# Altium schematic sheet Interface.SchDoc
size A4
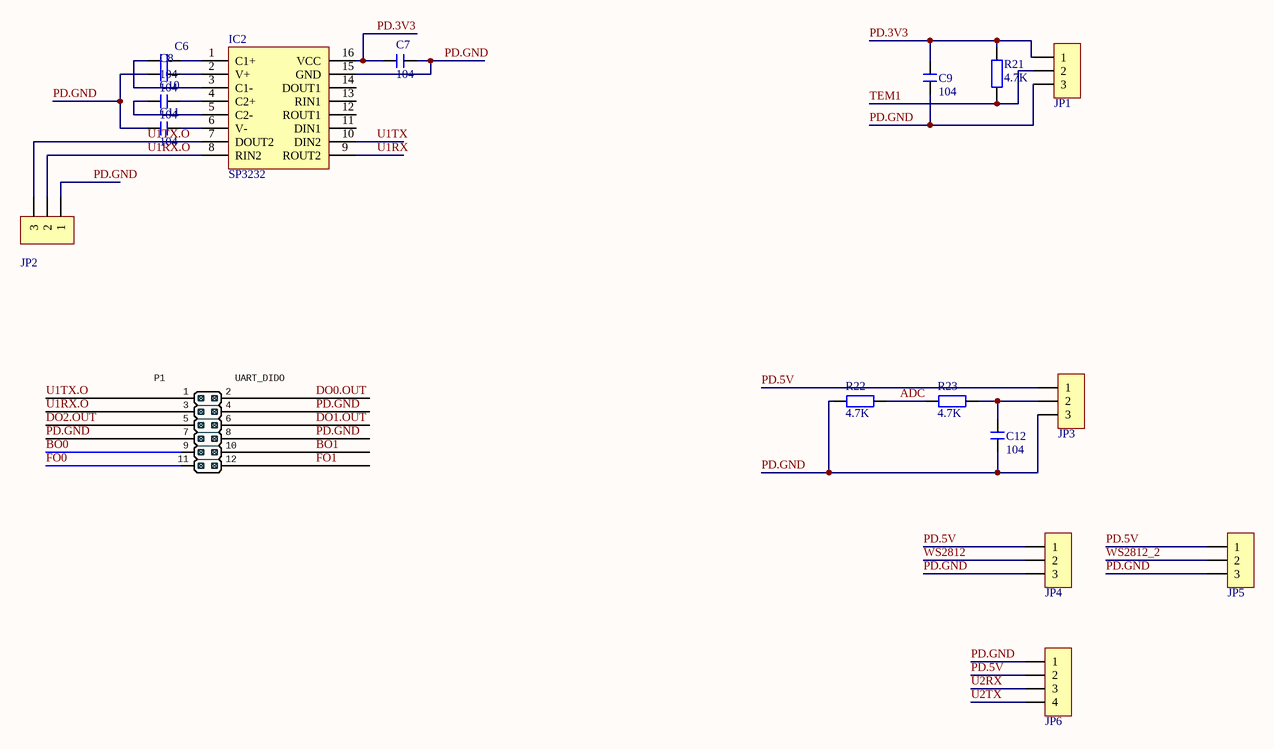
[diagram p0: Interface.SchDoc]

## Parts
C6  104  [C 0603]
C7  104  [C 0603]
C8  104  [C 0603]
C9  104  [C 0603]
C10  104  [C 0603]
C11  104  [C 0603]
C12  104  [C 0603]
IC2  SP3232  [TSSOP16_N]
JP1  HDR-1X3  [WJ15EDGRC-3.81-3P]  (value not drawn)
JP2  HDR-1X3  [XH2.54-3P]  (value not drawn)
JP3  HDR-1X3  [WJ15EDGRC-3.81-3P]  (value not drawn)
JP4  HDR-1X3  [WJ15EDGRC-3.81-3P]  (value not drawn)
JP5  HDR-1X3  [WJ15EDGRC-3.81-3P]  (value not drawn)
JP6  HDR-1X4  [XH2.54-4P]  (value not drawn)
P1  UART_DIDO  [KF2EDGRHM-3.81-2x6P]
R21  4.7K  [R 0603]
R22  4.7K  [R 0603]
R23  4.7K  [R 0603]

## Nets
ADC: R22.1 R23.2
BO0: P1.9
BO1: P1.10
DO0.OUT: P1.2
DO1.OUT: P1.6
DO2.OUT: P1.5
FO0: P1.11
FO1: P1.12
PD.3V3: C7.1 C9.2 IC2.16(VCC) JP1.1 R21.2
PD.5V: JP3.1 JP4.1 JP5.1 JP6.2
PD.GND: C7.2 C8.1 C9.1 C11.1 C12.1 IC2.15(GND) JP1.3 JP2.1 JP3.3 JP4.3 JP5.3 JP6.1 P1.4 P1.7 P1.8 R22.2
TEM1: JP1.2 R21.1
U1RX: IC2.9(ROUT2)
U1RX.O: IC2.8(RIN2) JP2.2 P1.3
U1TX: IC2.10(DIN2)
U1TX.O: IC2.7(DOUT2) JP2.3 P1.1
U2RX: JP6.3
U2TX: JP6.4
WS2812: JP4.2
WS2812_2: JP5.2
NetC6_1: C6.1 IC2.3(C1-)
NetC6_2: C6.2 IC2.1(C1+)
NetC8_2: C8.2 IC2.2(V+)
NetC10_1: C10.1 IC2.5(C2-)
NetC10_2: C10.2 IC2.4(C2+)
NetC11_2: C11.2 IC2.6(V-)
NetC12_2: C12.2 JP3.2 R23.1

Not connected (* = marked no-connect by the designer): IC2 11(DIN1) 12(ROUT1) 13(RIN1) 14(DOUT1)

## Library data of the parts
C6-C12 = C: 无极性贴片电容; 版权归属: 源创客; BOM名称: 无极性贴片电容; 学习资源: www.ooocke.com
IC2 = SP3232: RS232通讯芯片; 版权归属: 源创客; BOM名称: RS232通讯芯片; 学习资源: www.ooocke.com
JP1-JP5 = Header 3: 3P接插件; 版权归属: 源创客; BOM名称: 3P接插件; 学习资源: www.ooocke.com
JP6 = Header 4: 4P接插件; 版权归属: 源创客; BOM名称: 4P接插件; 学习资源: www.ooocke.com
P1 = PIN_2xCol_6xPin: P-EDG-2x6; 11_Name: 插装元件_KF2EDGRHM-3.5-12P
R21-R23 = R: 贴片电阻; 版权归属: 源创客; BOM名称: 贴片电阻; 学习资源: www.ooocke.com